# EAGLE design L298N v10 (EAGLE 5.11)
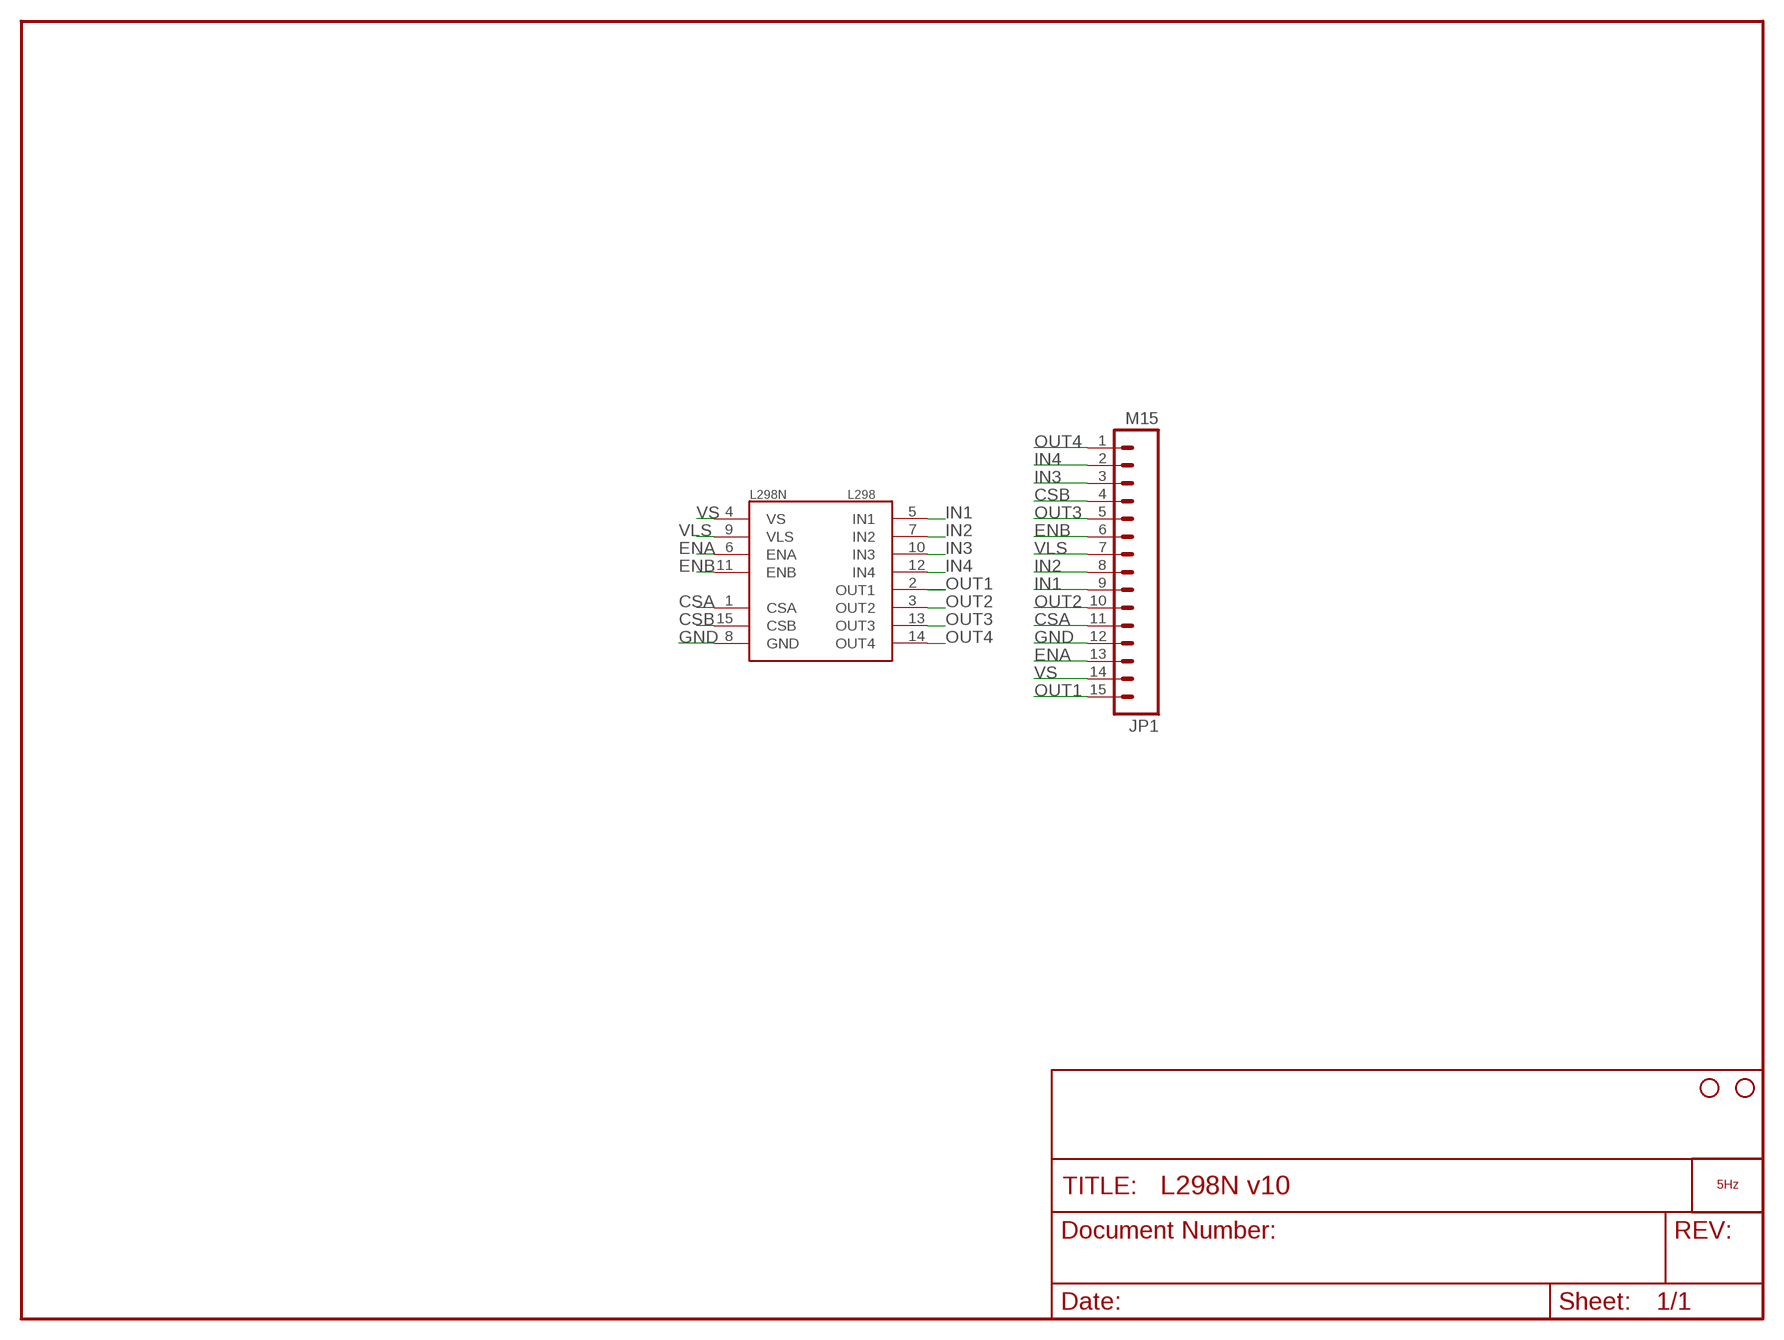
[diagram p0: schematic, sheet 1]

## Parts
JP1  M15  [1X15]
JP2  STAND-OFF  [STAND-OFF]
JP3  STAND-OFF  [STAND-OFF]
L298N  L298  [MULTIWATT15]
LOGO1  LOGO_5HZ_H_20MM  [5HZ_LOGO_H_20MM]

## Nets
CSA: JP1.11 L298N.1(CSA)
CSB: JP1.4 L298N.15(CSB)
ENA: JP1.13 L298N.6(ENA)
ENB: JP1.6 L298N.11(ENB)
GND: JP1.12 L298N.8(GND)
IN1: JP1.9 L298N.5(IN1)
IN2: JP1.8 L298N.7(IN2)
IN3: JP1.3 L298N.10(IN3)
IN4: JP1.2 L298N.12(IN4)
OUT1: JP1.15 L298N.2(OUT1)
OUT2: JP1.10 L298N.3(OUT2)
OUT3: JP1.5 L298N.13(OUT3)
OUT4: JP1.1 L298N.14(OUT4)
VLS: JP1.7 L298N.9(VLS)
VS: JP1.14 L298N.4(VS)

## Library data of the parts
JP1 = SparkFun:M15: Header 15 Standard 15-pin 0.1" header. Use with straight break away headers (SKU : PRT-00116), right angle break away headers (PRT-00553), swiss pins (PRT-00743), machine pins (PRT-00117), and female headers (PRT-00115).
JP2 JP3 = SparkFun:STAND-OFF: Stand Off This is the mechanical footprint for a #4 phillips button head screw. Use the keepout ring to avoid running the screw head into surrounding components. SKU : PRT-00447
L298N = SparkFun:L298: L298 Dual Full Bridge Driver
LOGO1 = 5hz-electronica:LOGO_5HZ: Logotipo 5Hz "según Pedro"

## Board
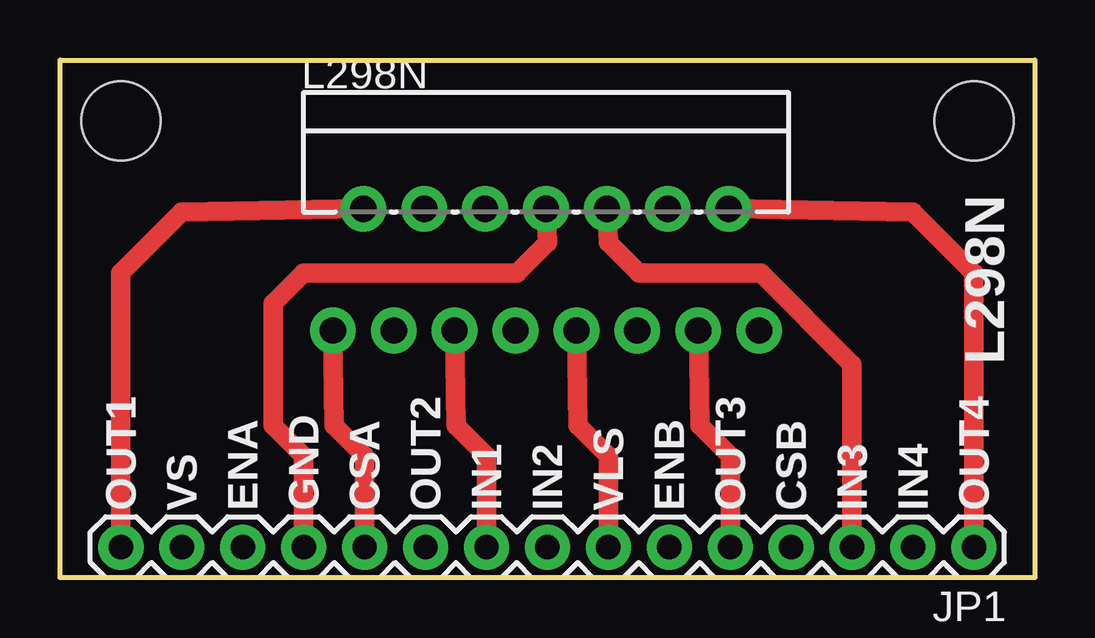
[diagram p1: board, top side]
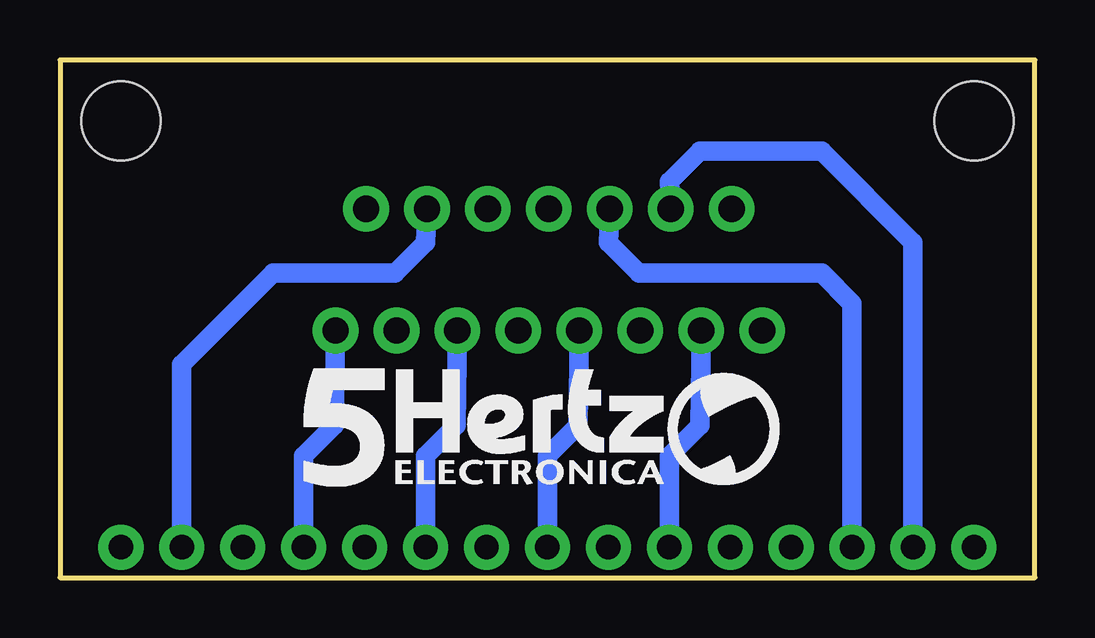
[diagram p2: board, bottom side, seen from below]

Size 40.64 x 21.59 mm. Coordinates in mm from the lower left corner, seen from the top.
Outline: 0,0 0,21.59 40.64,21.59 40.64,0 0,0
Copper layers (1*16): Top 0.035mm / dielectric 1.5mm / Bottom 0.035mm
Design rules "SparkFun": minimum track width 8mil, minimum drill 20mil, track to track 8mil, track to pad 8mil, pad to pad 8mil, via to via 8mil, smd to smd 8mil, copper to edge 9mil, drill to drill 8mil, minimum pad ring 12mil, minimum via ring 10mil, stop-mask expansion 4mil, vias tented up to drill 20mil, thermal gap 10mil

### Footprints (pad centres in the part's own frame; a part is rotated, then mirrored left to right if it is on the bottom)
1X15 = drill 1.016 pad 1.88 round: 1 0,0; 2 2.54,0; 3 5.08,0; 4 7.62,0; 5 10.16,0; 6 12.7,0; 7 15.24,0; 8 17.78,0; 9 20.32,0; 10 22.86,0; 11 25.4,0; 12 27.94,0; 13 30.48,0; 14 33.02,0; 15 35.56,0
STAND-OFF = hole 3.302: 0,0
MULTIWATT15 = drill 1.1 pad 1.9 round: 1 -8.95,-2.39; 2 -7.68,2.69; 3 -6.41,-2.39; 4 -5.14,2.69; 5 -3.87,-2.39; 6 -2.6,2.69; 7 -1.33,-2.39; 8 -0.06,2.69; 9 1.21,-2.39; 10 2.48,2.69; 11 3.75,-2.39; 12 5.02,2.69; 13 6.29,-2.39; 14 7.56,2.69; 15 8.83,-2.39

### Placement (x,y rotation side)
JP1  38.1,1.27 180 top
JP2  2.54,19.05 0 top
JP3  38.1,19.05 0 top
L298N  20.32,12.7 0 top
LOGO1  30.48,3.81 0 bottom

### Tracks (layer width: path | path; a pad name or v marks a point on that pad's centre or on a via)
CSA
  Top 0.813: JP1.11 12.7,5.08 11.43,6.35 L298N.1
CSB
  Bottom 0.813: JP1.4 30.48,5.08 29.21,6.35 L298N.15
ENA
  Bottom 0.813: JP1.13 7.62,11.43 8.89,12.7 16.51,12.7 17.78,13.97 L298N.6
ENB
  Bottom 0.813: JP1.6 25.4,5.08 24.13,6.35 L298N.11
GND
  Top 0.813: JP1.12 10.16,5.08 8.89,6.35 8.89,11.43 10.16,12.7 19.05,12.7 20.32,13.97 L298N.8
IN1
  Top 0.813: JP1.9 17.78,5.08 16.51,6.35 L298N.5
IN2
  Bottom 0.813: JP1.8 20.32,5.08 19.05,6.35 L298N.7
IN3
  Top 0.813: JP1.3 33.02,8.89 29.21,12.7 24.13,12.7 22.86,13.97 L298N.10
IN4
  Bottom 0.813: JP1.2 35.56,8.89 31.75,12.7 26.67,12.7 25.4,13.97 L298N.12
OUT1
  Top 0.813: JP1.15 2.54,12.7 5.08,15.24 L298N.2
OUT2
  Bottom 0.813: JP1.10 15.24,5.08 13.97,6.35 L298N.3
OUT3
  Top 0.813: JP1.5 27.94,5.08 26.67,6.35 L298N.13
OUT4
  Top 0.813: JP1.1 38.1,12.7 35.56,15.24 L298N.14
VLS
  Top 0.813: JP1.7 22.86,5.08 21.59,6.35 L298N.9
VS
  Bottom 0.813: JP1.14 5.08,13.97 8.89,17.78 13.97,17.78 15.24,16.51 L298N.4

### Text on the board
tPlace: L298N | OUT1 | VS | ENA | GND | CSA | OUT2 | IN1 | IN2 | VLS | ENB | OUT3 | CSB | IN3 | IN4 | OUT4